# Altium schematic sheet Peripherals.SchDoc: Pepherials
size 381 x 241 mm; CompanyName: Flat Earth Inc.; DrawnBy: Connor Dack; Engineer: Connor Dack; Address1: 985 Technology Blvd; Address2: Suite 102; Address3: Bozeman, MT, 59718; DocumentNumber: 8; Revision: 0.0; SheetNumber: 8; SheetTotal: 8
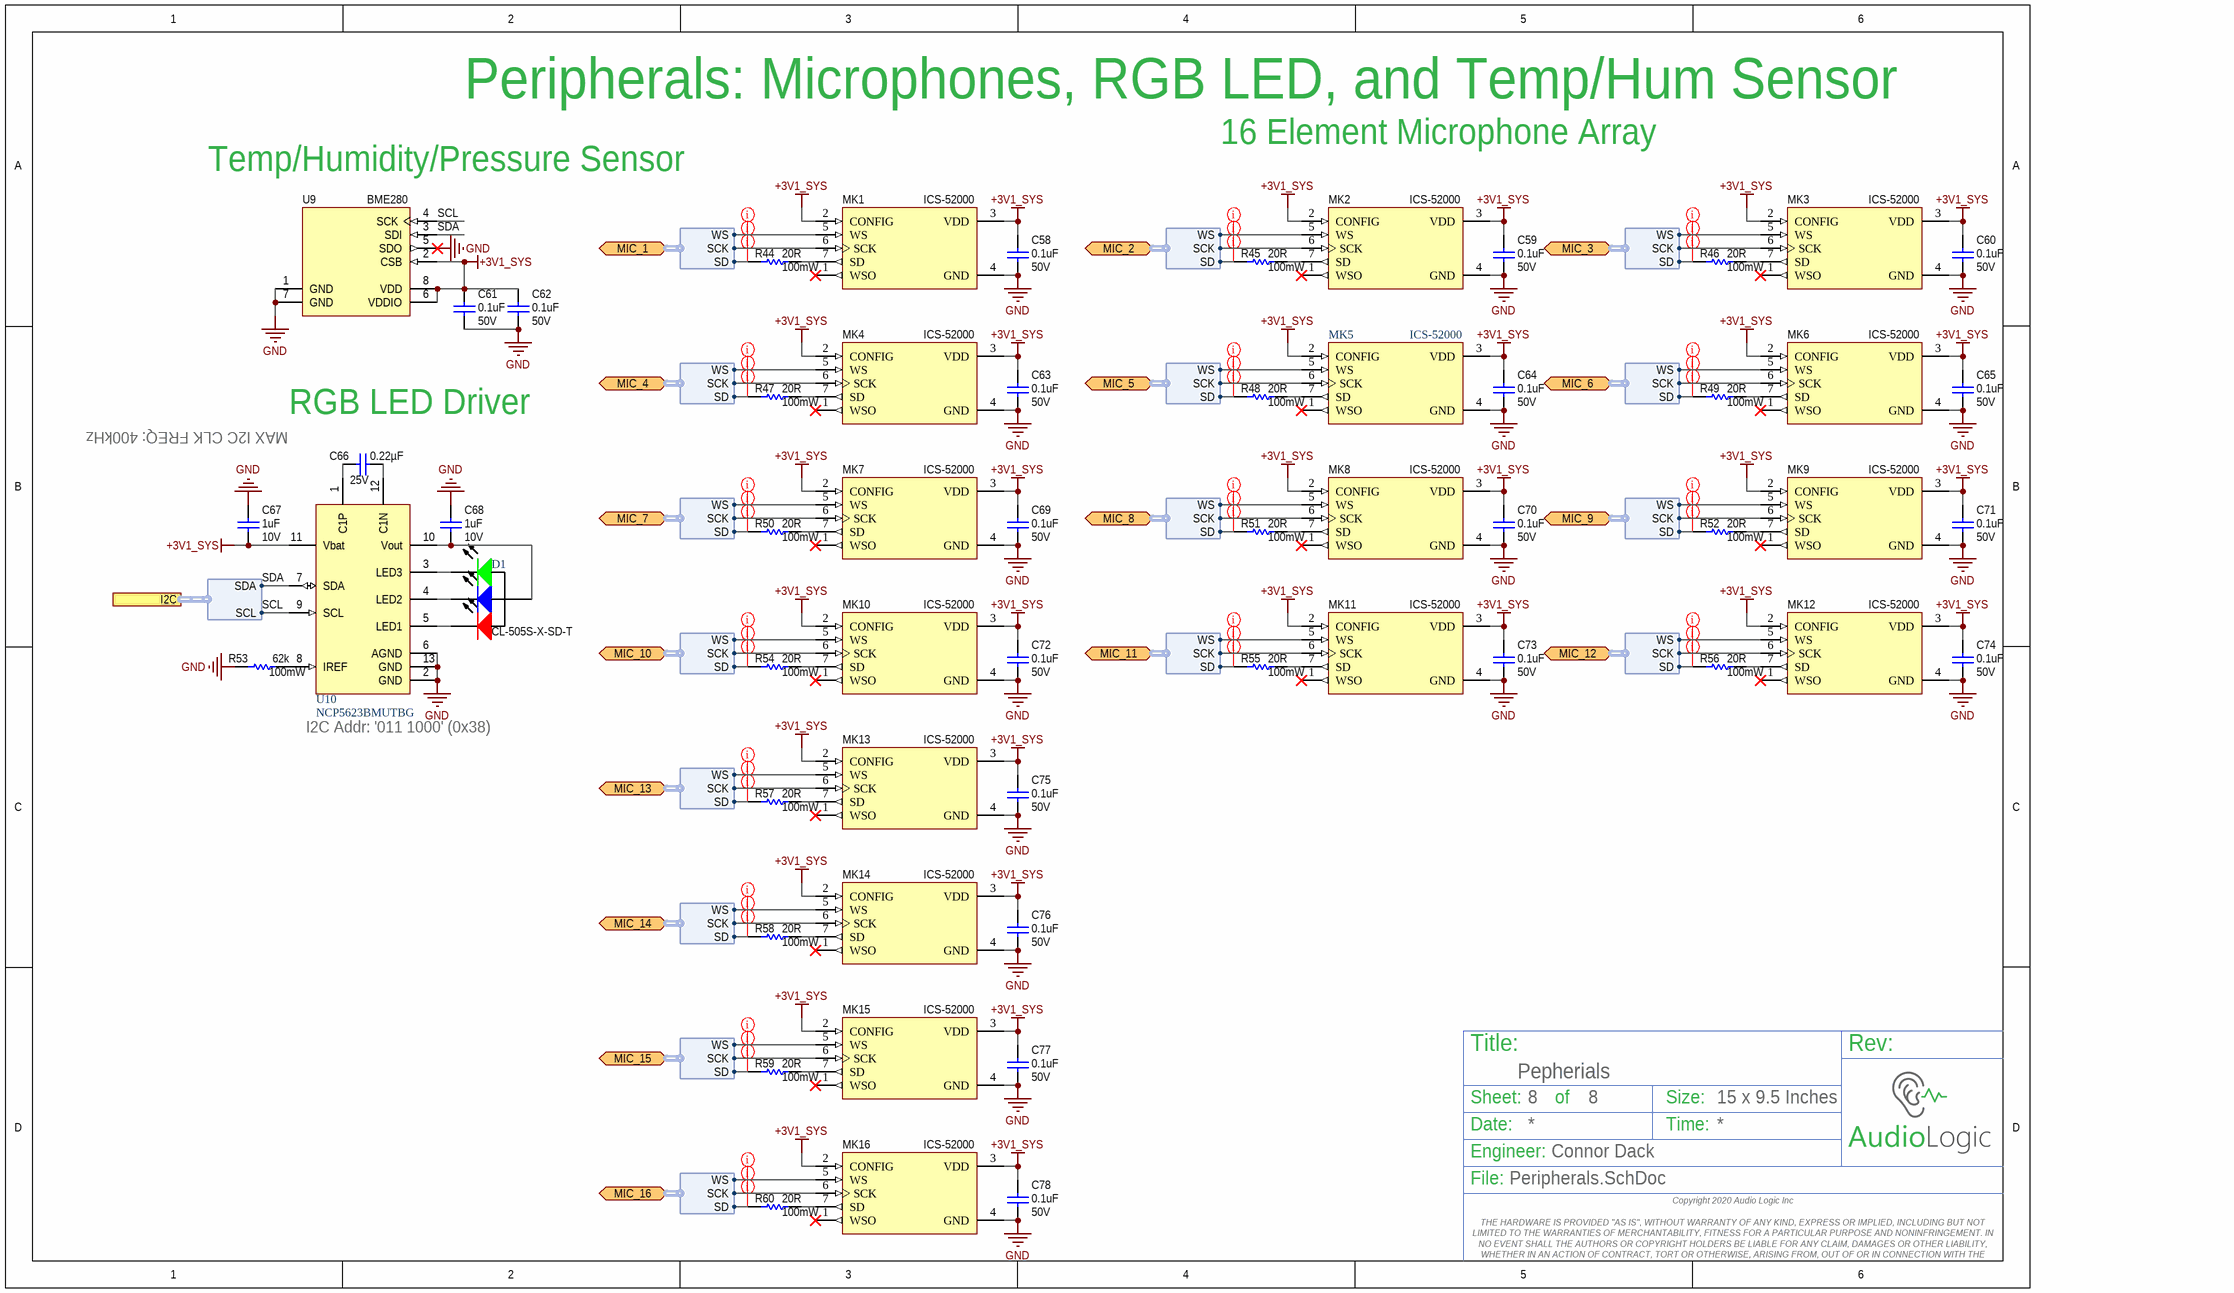
[diagram p0: Peripherals.SchDoc]

## Parts
C58  Capacitance: 0.1uF  Voltage Rating: 50V  [2-0402_L]  (hidden comment: UMK105B7104KVHF)
C59  Capacitance: 0.1uF  Voltage Rating: 50V  [2-0402_L]  (hidden comment: UMK105B7104KVHF)
C60  Capacitance: 0.1uF  Voltage Rating: 50V  [2-0402_L]  (hidden comment: UMK105B7104KVHF)
C61  Capacitance: 0.1uF  Voltage Rating: 50V  [2-0402_L]  (hidden comment: UMK105B7104KVHF)
C62  Capacitance: 0.1uF  Voltage Rating: 50V  [2-0402_L]  (hidden comment: UMK105B7104KVHF)
C63  Capacitance: 0.1uF  Voltage Rating: 50V  [2-0402_L]  (hidden comment: UMK105B7104KVHF)
C64  Capacitance: 0.1uF  Voltage Rating: 50V  [2-0402_L]  (hidden comment: UMK105B7104KVHF)
C65  Capacitance: 0.1uF  Voltage Rating: 50V  [2-0402_L]  (hidden comment: UMK105B7104KVHF)
C66  Voltage - Rated: 25V  Capacitance: 0.22µF  [2-0402_L]  (hidden comment: C1005X7R1E224K050BB)
C67  Voltage Rating: 10V  Capacitance: 1uF  [2-0402_L]  (hidden comment: CGB2A1X5R1A105K033BC)
C68  Voltage Rating: 10V  Capacitance: 1uF  [2-0402_L]  (hidden comment: CGB2A1X5R1A105K033BC)
C69  Capacitance: 0.1uF  Voltage Rating: 50V  [2-0402_L]  (hidden comment: UMK105B7104KVHF)
C70  Capacitance: 0.1uF  Voltage Rating: 50V  [2-0402_L]  (hidden comment: UMK105B7104KVHF)
C71  Capacitance: 0.1uF  Voltage Rating: 50V  [2-0402_L]  (hidden comment: UMK105B7104KVHF)
C72  Capacitance: 0.1uF  Voltage Rating: 50V  [2-0402_L]  (hidden comment: UMK105B7104KVHF)
C73  Capacitance: 0.1uF  Voltage Rating: 50V  [2-0402_L]  (hidden comment: UMK105B7104KVHF)
C74  Capacitance: 0.1uF  Voltage Rating: 50V  [2-0402_L]  (hidden comment: UMK105B7104KVHF)
C75  Capacitance: 0.1uF  Voltage Rating: 50V  [2-0402_L]  (hidden comment: UMK105B7104KVHF)
C76  Capacitance: 0.1uF  Voltage Rating: 50V  [2-0402_L]  (hidden comment: UMK105B7104KVHF)
C77  Capacitance: 0.1uF  Voltage Rating: 50V  [2-0402_L]  (hidden comment: UMK105B7104KVHF)
C78  Capacitance: 0.1uF  Voltage Rating: 50V  [2-0402_L]  (hidden comment: UMK105B7104KVHF)
D1  LED TRI TOP FIRING 1.0 X 1.0  [CL-505S]  (value not drawn)
MK1  ICS-52000  [MIC_ICS-52000]
MK2  ICS-52000  [MIC_ICS-52000]
MK3  ICS-52000  [MIC_ICS-52000]
MK4  ICS-52000  [MIC_ICS-52000]
MK5  ICS-52000  [MIC_ICS-52000]
MK6  ICS-52000  [MIC_ICS-52000]
MK7  ICS-52000  [MIC_ICS-52000]
MK8  ICS-52000  [MIC_ICS-52000]
MK9  ICS-52000  [MIC_ICS-52000]
MK10  ICS-52000  [MIC_ICS-52000]
MK11  ICS-52000  [MIC_ICS-52000]
MK12  ICS-52000  [MIC_ICS-52000]
MK13  ICS-52000  [MIC_ICS-52000]
MK14  ICS-52000  [MIC_ICS-52000]
MK15  ICS-52000  [MIC_ICS-52000]
MK16  ICS-52000  [MIC_ICS-52000]
R44  Resistance: 20R  Power Rating: 100mW  [RESC1005X40X25LL05T05]  (hidden comment: ERJ-2RKF20R0X)
R45  Resistance: 20R  Power Rating: 100mW  [RESC1005X40X25LL05T05]  (hidden comment: ERJ-2RKF20R0X)
R46  Resistance: 20R  Power Rating: 100mW  [RESC1005X40X25LL05T05]  (hidden comment: ERJ-2RKF20R0X)
R47  Resistance: 20R  Power Rating: 100mW  [RESC1005X40X25LL05T05]  (hidden comment: ERJ-2RKF20R0X)
R48  Resistance: 20R  Power Rating: 100mW  [RESC1005X40X25LL05T05]  (hidden comment: ERJ-2RKF20R0X)
R49  Resistance: 20R  Power Rating: 100mW  [RESC1005X40X25LL05T05]  (hidden comment: ERJ-2RKF20R0X)
R50  Resistance: 20R  Power Rating: 100mW  [RESC1005X40X25LL05T05]  (hidden comment: ERJ-2RKF20R0X)
R51  Resistance: 20R  Power Rating: 100mW  [RESC1005X40X25LL05T05]  (hidden comment: ERJ-2RKF20R0X)
R52  Resistance: 20R  Power Rating: 100mW  [RESC1005X40X25LL05T05]  (hidden comment: ERJ-2RKF20R0X)
R53  Power (Watts): 100mW  Resistance (Ohms): 62k  [2-0402_R_L]  (hidden comment: ERJ-2GEJ623X)
R54  Resistance: 20R  Power Rating: 100mW  [RESC1005X40X25LL05T05]  (hidden comment: ERJ-2RKF20R0X)
R55  Resistance: 20R  Power Rating: 100mW  [RESC1005X40X25LL05T05]  (hidden comment: ERJ-2RKF20R0X)
R56  Resistance: 20R  Power Rating: 100mW  [RESC1005X40X25LL05T05]  (hidden comment: ERJ-2RKF20R0X)
R57  Resistance: 20R  Power Rating: 100mW  [RESC1005X40X25LL05T05]  (hidden comment: ERJ-2RKF20R0X)
R58  Resistance: 20R  Power Rating: 100mW  [RESC1005X40X25LL05T05]  (hidden comment: ERJ-2RKF20R0X)
R59  Resistance: 20R  Power Rating: 100mW  [RESC1005X40X25LL05T05]  (hidden comment: ERJ-2RKF20R0X)
R60  Resistance: 20R  Power Rating: 100mW  [RESC1005X40X25LL05T05]  (hidden comment: ERJ-2RKF20R0X)
U9  BME280  [BOSC-BME280-8_V]
U10  IC LED DRIVER RGLTR 30MA 12LLGA  [513AA]  (value not drawn)

## Ports
I2C (harness I2C), MIC_1 (bidir, harness MIC_1), MIC_2 (bidir, harness MIC_2), MIC_3 (bidir, harness MIC_3), MIC_4 (bidir, harness MIC_4), MIC_5 (bidir, harness MIC_5), MIC_6 (bidir, harness MIC_6), MIC_7 (bidir, harness MIC_7), MIC_8 (bidir, harness MIC_8), MIC_9 (bidir, harness MIC_9), MIC_10 (bidir, harness MIC_10), MIC_11 (bidir, harness MIC_11), MIC_12 (bidir, harness MIC_12), MIC_13 (bidir, harness MIC_13), MIC_14 (bidir, harness MIC_14), MIC_15 (bidir, harness MIC_15), MIC_16 (bidir, harness MIC_16)

## Harnesses
I2C: SCL, SDA
MIC_1: WS, SCK, SD
MIC_4: WS, SCK, SD
MIC_7: WS, SCK, SD
MIC_10: WS, SCK, SD
MIC_13: WS, SCK, SD
MIC_14: WS, SCK, SD
MIC_15: WS, SCK, SD
MIC_16: WS, SCK, SD
MIC_2: WS, SCK, SD
MIC_5: WS, SCK, SD
MIC_8: WS, SCK, SD
MIC_11: WS, SCK, SD
MIC_3: WS, SCK, SD
MIC_6: WS, SCK, SD
MIC_9: WS, SCK, SD
MIC_12: WS, SCK, SD

## Nets
+3V1_SYS: C58.2 C59.2 C60.2 C61.2 C62.2 C63.2 C64.2 C65.2 C67.2 C69.2 C70.2 C71.2 C72.2 C73.2 C74.2 C75.2 C76.2 C77.2 C78.2 MK1.2(CONFIG) MK1.3(VDD) MK2.2(CONFIG) MK2.3(VDD) MK3.2(CONFIG) MK3.3(VDD) MK4.2(CONFIG) MK4.3(VDD) MK5.2(CONFIG) MK5.3(VDD) MK6.2(CONFIG) MK6.3(VDD) MK7.2(CONFIG) MK7.3(VDD) MK8.2(CONFIG) MK8.3(VDD) MK9.2(CONFIG) MK9.3(VDD) MK10.2(CONFIG) MK10.3(VDD) MK11.2(CONFIG) MK11.3(VDD) MK12.2(CONFIG) MK12.3(VDD) MK13.2(CONFIG) MK13.3(VDD) MK14.2(CONFIG) MK14.3(VDD) MK15.2(CONFIG) MK15.3(VDD) MK16.2(CONFIG) MK16.3(VDD) U9.2(CSB) U9.6(VDDIO) U9.8(VDD) U10.11(Vbat)
GND: C58.1 C59.1 C60.1 C61.1 C62.1 C63.1 C64.1 C65.1 C67.1 C68.2 C69.1 C70.1 C71.1 C72.1 C73.1 C74.1 C75.1 C76.1 C77.1 C78.1 MK1.4(GND) MK2.4(GND) MK3.4(GND) MK4.4(GND) MK5.4(GND) MK6.4(GND) MK7.4(GND) MK8.4(GND) MK9.4(GND) MK10.4(GND) MK11.4(GND) MK12.4(GND) MK13.4(GND) MK14.4(GND) MK15.4(GND) MK16.4(GND) R53.1 U9.1(GND) U9.5(SDO) U9.7(GND) U10.2(GND) U10.6(AGND) U10.13(GND)
SCL: U9.4(SCK) U10.9(SCL) ; port I2C.SCL
SDA: U9.3(SDI) U10.7(SDA) ; port I2C.SDA
NetC66_1: C66.1 U10.1(C1P)
NetC66_2: C66.2 U10.12(C1N)
NetC68_1: C68.1 D1.4(A) U10.10(Vout)
NetD1_1: D1.1(K) U10.4(LED2)
NetD1_2: D1.2(K) U10.5(LED1)
NetD1_3: D1.3(K) U10.3(LED3)
NetMK1_5: MK1.5(WS) ; port MIC_1.WS
NetMK1_6: MK1.6(SCK) ; port MIC_1.SCK
NetMK1_7: MK1.7(SD) R44.2
NetMK2_5: MK2.5(WS) ; port MIC_2.WS
NetMK2_6: MK2.6(SCK) ; port MIC_2.SCK
NetMK2_7: MK2.7(SD) R45.2
NetMK3_5: MK3.5(WS) ; port MIC_3.WS
NetMK3_6: MK3.6(SCK) ; port MIC_3.SCK
NetMK3_7: MK3.7(SD) R46.2
NetMK4_5: MK4.5(WS) ; port MIC_4.WS
NetMK4_6: MK4.6(SCK) ; port MIC_4.SCK
NetMK4_7: MK4.7(SD) R47.2
NetMK5_5: MK5.5(WS) ; port MIC_5.WS
NetMK5_6: MK5.6(SCK) ; port MIC_5.SCK
NetMK5_7: MK5.7(SD) R48.2
NetMK6_5: MK6.5(WS) ; port MIC_6.WS
NetMK6_6: MK6.6(SCK) ; port MIC_6.SCK
NetMK6_7: MK6.7(SD) R49.2
NetMK7_5: MK7.5(WS) ; port MIC_7.WS
NetMK7_6: MK7.6(SCK) ; port MIC_7.SCK
NetMK7_7: MK7.7(SD) R50.2
NetMK8_5: MK8.5(WS) ; port MIC_8.WS
NetMK8_6: MK8.6(SCK) ; port MIC_8.SCK
NetMK8_7: MK8.7(SD) R51.2
NetMK9_5: MK9.5(WS) ; port MIC_9.WS
NetMK9_6: MK9.6(SCK) ; port MIC_9.SCK
NetMK9_7: MK9.7(SD) R52.2
NetMK10_5: MK10.5(WS) ; port MIC_10.WS
NetMK10_6: MK10.6(SCK) ; port MIC_10.SCK
NetMK10_7: MK10.7(SD) R54.2
NetMK11_5: MK11.5(WS) ; port MIC_11.WS
NetMK11_6: MK11.6(SCK) ; port MIC_11.SCK
NetMK11_7: MK11.7(SD) R55.2
NetMK12_5: MK12.5(WS) ; port MIC_12.WS
NetMK12_6: MK12.6(SCK) ; port MIC_12.SCK
NetMK12_7: MK12.7(SD) R56.2
NetMK13_5: MK13.5(WS) ; port MIC_13.WS
NetMK13_6: MK13.6(SCK) ; port MIC_13.SCK
NetMK13_7: MK13.7(SD) R57.2
NetMK14_5: MK14.5(WS) ; port MIC_14.WS
NetMK14_6: MK14.6(SCK) ; port MIC_14.SCK
NetMK14_7: MK14.7(SD) R58.2
NetMK15_5: MK15.5(WS) ; port MIC_15.WS
NetMK15_6: MK15.6(SCK) ; port MIC_15.SCK
NetMK15_7: MK15.7(SD) R59.2
NetMK16_5: MK16.5(WS) ; port MIC_16.WS
NetMK16_6: MK16.6(SCK) ; port MIC_16.SCK
NetMK16_7: MK16.7(SD) R60.2
NetR44_1: R44.1 ; port MIC_1.SD
NetR45_1: R45.1 ; port MIC_2.SD
NetR46_1: R46.1 ; port MIC_3.SD
NetR47_1: R47.1 ; port MIC_4.SD
NetR48_1: R48.1 ; port MIC_5.SD
NetR49_1: R49.1 ; port MIC_6.SD
NetR50_1: R50.1 ; port MIC_7.SD
NetR51_1: R51.1 ; port MIC_8.SD
NetR52_1: R52.1 ; port MIC_9.SD
NetR53_2: R53.2 U10.8(IREF)
NetR54_1: R54.1 ; port MIC_10.SD
NetR55_1: R55.1 ; port MIC_11.SD
NetR56_1: R56.1 ; port MIC_12.SD
NetR57_1: R57.1 ; port MIC_13.SD
NetR58_1: R58.1 ; port MIC_14.SD
NetR59_1: R59.1 ; port MIC_15.SD
NetR60_1: R60.1 ; port MIC_16.SD

Not connected (* = marked no-connect by the designer): MK1 1(WSO)*; MK2 1(WSO)*; MK3 1(WSO)*; MK4 1(WSO)*; MK5 1(WSO)*; MK6 1(WSO)*; MK7 1(WSO)*; MK8 1(WSO)*; MK9 1(WSO)*; MK10 1(WSO)*; MK11 1(WSO)*; MK12 1(WSO)*; MK13 1(WSO)*; MK14 1(WSO)*; MK15 1(WSO)*; MK16 1(WSO)*

## Layout directives
net class Mic Clock: NetMK1_6, NetMK2_6, NetMK3_6, NetMK4_6, NetMK5_6, NetMK6_6, NetMK8_6, NetMK9_6, NetMK11_6, NetMK12_6, NetMK13_6, NetMK14_6, NetMK15_6, NetMK16_6
net class Mic Clock; rule Matched Net Lengths [Tolerance = 10mil]; rule Matched Net Lengths [Tolerance = 10mil]: NetMK7_6
net class Mic Clock; rule Matched Net Lengths [Tolerance = 10mil]: NetMK10_6
net class Mic WS; rule Matched Net Lengths [Tolerance = 10mil]: NetMK1_5, NetMK2_5, NetMK3_5, NetMK4_5, NetMK5_5, NetMK6_5, NetMK7_5, NetMK8_5, NetMK9_5, NetMK10_5, NetMK11_5, NetMK12_5, NetMK13_5, NetMK14_5, NetMK15_5, NetMK16_5
net class Mic SD; rule Matched Net Lengths [Tolerance = 10mil]: NetR44_1, NetR45_1, NetR46_1, NetR47_1, NetR48_1, NetR49_1, NetR50_1, NetR51_1, NetR52_1, NetR54_1, NetR55_1, NetR56_1, NetR57_1, NetR58_1, NetR59_1, NetR60_1

## Notes on the sheet
- Peripherals: Microphones, RGB LED, and Temp/Hum Sensor
- 16 Element Microphone Array
- (near U9) Temp/Humidity/Pressure Sensor
- (near C66) RGB LED Driver
- (near C66) MAX I2C CLK FREQ: 400kHz
- I2C Addr: '011 1000' (0x38)
- Title:
- Sheet:
- of
- Size:
- 15 x 9.5 Inches
- Rev:
- Date:
- Engineer:
- Time:
- File:
- Copyright 2020 Audio Logic Inc
  THE HARDWARE IS PROVIDED "AS IS", WITHOUT WARRANTY OF ANY KIND, EXPRESS OR IMPLIED, INCLUDING BUT NOT LIMITED TO THE WARRANTIES OF MERCHANTABILITY, FITNESS FOR A PARTICULAR PURPOSE AND NONINFRINGEMENT. IN NO EVENT SHALL THE AUTHORS OR COPYRIGHT HOLDERS BE LIABLE FOR ANY CLAIM, DAMAGES OR OTHER LIABILITY, WHETHER IN AN ACTION OF CONTRACT, TORT OR OTHERWISE, ARISING FROM, OUT OF OR IN CONNECTION WITH THE HARDWARE OR THE USE OR OTHER DEALINGS IN THE HARDWARE.

## Library data of the parts
C58-C65 C69-C78 = UMK105B7104KVHF: CAP CER 0.1uF 50V X7R +/-10% 0402 AEC-Q200; Manufacturer: Taiyo Yuden; Tolerance: 10%; Supplier 1: Digi-Key; Manufacturer Part Number: UMK105B7104KVHF; Stock 1: 100000; Pricing 1: 1=0.23, 10=0.165, 100=0.0775, 500=0.05436, 1000=0.04501, 2500=0.04189, 5000=0.03832 (USD); Packaging: Tape and Reel; ComponentLink1URL: http://www.yuden.co.jp/productdata/catalog/en/mlcc01_hq_e.pdf; ComponentLink1Description: http://www.yuden.co.jp/productdata/catalog/en/mlcc01_hq_e.pdf; Supplier Part Number 1: 587-4330-1-ND; Mount: Surface Mount; Case/Package: 0402; Case Code (Metric): 1005; Case Code (Imperial): 0402; Min Operating Temperature: -55°C; Max Operating Temperature: 125°C; Package Quantity: 10000; Dielectric: X7R; Voltage Rating (DC): 50V; Length: 0.039inch; Height: 0.5mm; Width: 0.02inch; Thickness: 0.022inch; ComponentLink2URL: http://ds.yuden.co.jp/TYCOMPAS/ut/detail.do?productNo=UMK105B7104KVHF&fileName=UMK105B7104KVHF_SS&mode=specSheetDownload; ComponentLink2Description: http://ds.yuden.co.jp/TYCOMPAS/ut/detail.do?productNo=UMK105B7104KVHF&fileName=UMK105B7104KVHF_SS&mode=specSheetDownload; ComponentLink3URL: http://www.mouser.com/ds/2/396/mlcc11_hq_e-541564.pdf; ComponentLink3Description: http://www.mouser.com/ds/2/396/mlcc11_hq_e-541564.pdf; ComponentLink4URL: http://ds.yuden.co.jp/TYCOMPAS/ut/detail.do?productNo=UMK105B7104KVHF&dataUnit=M; ComponentLink4Description: http://ds.yuden.co.jp/TYCOMPAS/ut/detail.do?productNo=UMK105B7104KVHF&dataUnit=M; Weight: 2.3E-05oz; Termination: SMD/SMT
C66 = C1005X7R1E224K050BB: CAP CER 0.22UF 25V X7R 0402; Manufacturer: TDK Corporation; Tolerance: ±10%; Supplier 1: Digi-Key; Manufacturer Part Number: C1005X7R1E224K050BB; RoHS: RoHS Compliant; Category: Capacitors; Stock 1: 304; Pricing 1: 1=0.17, 10=0.12, 100=0.057, 250=0.048, 500=0.0402, 1000=0.033, 5000=0.0279 (USD); Packaging: Cut Tape (CT); Part Status: Active; Temperature Coefficient: X7R; Operating Temperature: -55°C ~ 125°C; Features: Low ESL; Ratings: -; Applications: General Purpose; Failure Rate: -; Mounting Type: Surface Mount, MLCC; Package / Case: 0402 (1005 Metric); Size / Dimension: 0.039" L x 0.020" W (1.00mm x 0.50mm); Height - Seated (Max): -; Thickness (Max): 0.022" (0.55mm); Lead Spacing: -; Lead Style: -; ComponentLink1URL: https://product.tdk.com/info/en/catalog/datasheets/mlcc_commercial_general_en.pdf; ComponentLink1Description: https://product.tdk.com/info/en/catalog/datasheets/mlcc_commercial_general_en.pdf; Supplier Part Number 1: 445-174421-1-ND
C67 C68 = CGB2A1X5R1A105K033BC: CAP CER 1UF 10V X5R 0402; Manufacturer: TDK; Tolerance: 10%; Supplier 1: Digi-Key; Manufacturer Part Number: CGB2A1X5R1A105K033BC; Stock 1: 48118; Pricing 1: 1=0.2, 10=0.14, 100=0.066, 500=0.0463, 1000=0.0383, 2500=0.0357, 5000=0.0326 (USD); Mount: Surface Mount; Case/Package: 0402; Case Code (Metric): 1005; Case Code (Imperial): 0402; Min Operating Temperature: -55°C; Max Operating Temperature: 85°C; Package Quantity: 10000; Packaging: Tape and Reel; Length: 0.039inch; Width: 0.02inch; Thickness: 0.013inch; Lead Free: Lead Free; ComponentLink1URL: http://product.tdk.com/en/catalog/datasheets/mlcc_commercial_lowprofile_en.pdf; ComponentLink1Description: http://product.tdk.com/en/catalog/datasheets/mlcc_commercial_lowprofile_en.pdf; ComponentLink2URL: https://product.tdk.com/info/en/catalog/datasheets/mlcc_commercial_lowprofile_en.pdf; ComponentLink2Description: https://product.tdk.com/info/en/catalog/datasheets/mlcc_commercial_lowprofile_en.pdf; Supplier Part Number 1: 445-13179-1-ND
D1 = CL-505S-X-SD-T: Red, Green, Blue (RGB) 615nm Red, 530nm Green, 470nm Blue LED Indication - Discrete 1.85V Red, 2.7V Green, 2.75V Blue 0404 (1010 Metric); Manufacturer: Citizen; Colour: Blue,Green,Red; Luminous Intensity: 65mcd; Test Current: 5mA; Mount: Surface Mount; Case/Package: 0404; Case Code (Metric): 1010; Case Code (Imperial): 0404; Packaging: Tape and Reel; Dominant Wavelength: 470nm; Forward Voltage: 2.75V; Length: 1mm; Height: 0.26mm; Width: 1mm; Manufacturer Part Number: CL-505S-X-SD-T; ComponentLink1Description: CL-505S Datasheet; ComponentLink1URL: http://ce.citizen.co.jp/up_img/product/sQNrj4RlM7o2/CL-505S_e.pdf
MK1-MK16 = ICS-52000: MIC MEMS DIGITAL OMNI -26DB; Manufacturer: TDK InvenSense; Supplier 1: Digi-Key; Manufacturer Part Number: ICS-52000; RoHS: No; Category: Microphones; Stock 1: 3554; Pricing 1: 1=4.06000, 10=3.35700, 25=3.09760, 50=2.90920, 100=2.72790, 500=2.35338 (USD); ComponentLink1URL: http://www.farnell.com/datasheets/2632667.pdf?src-supplier=Farnell; ComponentLink1Description: http://www.farnell.com/datasheets/2632667.pdf?src-supplier=Farnell; ComponentLink2URL: https://www.invensense.com/wp-content/uploads/2016/05/PB-000039-ICS-52000-v0.1.pdf?src-supplier=Digi-Key; ComponentLink2Description: https://www.invensense.com/wp-content/uploads/2016/05/PB-000039-ICS-52000-v0.1.pdf?src-supplier=Digi-Key; ComponentLink3URL: https://www.invensense.com/wp-content/uploads/2016/05/DS-000121-ICS-52000-v1.3.pdf?src-supplier=Digi-Key; ComponentLink3Description: https://www.invensense.com/wp-content/uploads/2016/05/DS-000121-ICS-52000-v1.3.pdf?src-supplier=Digi-Key; Supplier Part Number 1: 1428-1122-1-ND
R44-R52 R54-R60 = CMP-2002-00765-1: RES SMD 20 OHM 1% 1/10W 0402; Manufacturer: Panasonic; Voltage Rating: 50V; Temperature Coefficient: 100ppm/°C; Part Number: ERJ-2RKF20R0X; Supplier 1: Digi-Key; Supplier Part Number 1: P20.0LCT-ND; Manufacturer Part Number: ERJ-2RKF20R0X; RoHS: Yes; Category: Chip SMD Resistors; Stock 1: 156306; Pricing 1: 1=0.10000, 10=0.04100, 100=0.01670, 1000=0.00751, 2500=0.00652, 5000=0.00538 (USD); Mount: Surface Mount; Case/Package: 0402; Weight: 2.8E-05oz; Case Code (Metric): 1005; Case Code (Imperial): 0402; Contact Plating: Tin; Min Operating Temperature: -55°C; Max Operating Temperature: 155°C; Tolerance: 1%; Packaging: Tape and Reel; Package Quantity: 1; Composition: Thick Film; Number of Terminations: 2; Termination: SMD/SMT; Military Standard: Not; Max Power Dissipation: 100mW; Voltage Rating (DC): 50V; Features: Automotive AEC-Q200; Length: 1mm; Height: 0.35mm; Width: 0.02inch; Depth: 0.5mm; REACH SVHC: No SVHC; Lead Free: Lead Free; ComponentLink1URL: https://datasheet.ciiva.com/11821/0900766b80f80784-11821238.pdf?src-supplier=RSComponents; ComponentLink1Description: https://datasheet.ciiva.com/11821/0900766b80f80784-11821238.pdf?src-supplier=RSComponents; ComponentLink2URL: https://datasheet.ciiva.com/28665/1678782-28665382.pdf?src-supplier=Element14; ComponentLink2Description: https://datasheet.ciiva.com/28665/1678782-28665382.pdf?src-supplier=Element14; ComponentLink3URL: https://datasheet.ciiva.com/43460/426256-43460268.pdf?src-supplier=Farnell; ComponentLink3Description: https://datasheet.ciiva.com/43460/426256-43460268.pdf?src-supplier=Farnell; ComponentLink4URL: https://datasheet.ciiva.com/24159/aoa0000ce2-24159789.pdf?src-supplier=Mouser; ComponentLink4Description: https://datasheet.ciiva.com/24159/aoa0000ce2-24159789.pdf?src-supplier=Mouser; ComponentLink5URL: https://datasheet.ciiva.com/16769/70260748-16769269.pdf?src-supplier=Allied+Electronics; ComponentLink5Description: https://datasheet.ciiva.com/16769/70260748-16769269.pdf?src-supplier=Allied+Electronics; ComponentLink6URL: https://datasheet.ciiva.com/16780/70260748-16780614.pdf?src-supplier=Allied+Electronics; ComponentLink6Description: https://datasheet.ciiva.com/16780/70260748-16780614.pdf?src-supplier=Allied+Electronics; ComponentLink7URL: https://datasheet.ciiva.com/46386/426256-46386872.pdf?src-supplier=Element14; ComponentLink7Description: https://datasheet.ciiva.com/46386/426256-46386872.pdf?src-supplier=Element14
R53 = ERJ-2GEJ623X: RES SMD 62K OHM 5% 1/10W 0402; Manufacturer: Panasonic Electronic Components; Temperature Coefficient: ±200ppm/°C; Supplier 1: Digi-Key; Manufacturer Part Number: ERJ-2GEJ623X; RoHS: RoHS Compliant; Category: Resistors; Stock 1: 135575; Pricing 1: 1=0.1, 10=0.017, 25=0.0128, 50=0.0096, 100=0.0071, 250=0.0054, 500=0.00432, 1000=0.00318, 5000=0.00228 (USD); Packaging: Cut Tape (CT); Part Status: Active; Tolerance: ±5%; Composition: Thick Film; Features: Automotive AEC-Q200; Operating Temperature: -55°C ~ 155°C; Package / Case: 0402 (1005 Metric); Supplier Device Package: 0402; Size / Dimension: 0.039" L x 0.020" W (1.00mm x 0.50mm); Height - Seated (Max): 0.016" (0.40mm); Number of Terminations: 2; Failure Rate: -; ComponentLink1URL: http://industrial.panasonic.com/www-cgi/jvcr13pz.cgi?E+PZ+3+AOA0001+ERJ2GEJ623X+7+WW; ComponentLink1Description: http://industrial.panasonic.com/www-cgi/jvcr13pz.cgi?E+PZ+3+AOA0001+ERJ2GEJ623X+7+WW; Supplier Part Number 1: P62KJCT-ND
U9 = CMP-2000-05073-1: Combined Humidity and Pressure Sensor, 1.71 to 3.6 V, -40 to 85 degC, 8-Pin SMD, RoHS, Tape and Reel; Manufacturer: Bosch Sensortec; Datasheet Version: Rev. 1.2, 10/2015; Datasheet URL: http://datasheet.octopart.com/BME280-Bosch-datasheet-58577763.pdf; Manufacturer URL: http://www.bosch-sensortec.com
U10 = NCP5623BMUTBG: LED Driver IC 3 Output DC DC Regulator Switched Capacitor (Charge Pump) 30mA 12-LLGA (2x2); Manufacturer: ON Semiconductor; Output Voltage: 5.7V; Output Current: 90mA; Min Supply Voltage: 2.7V; Max Supply Voltage: 5.5V; Number of Outputs: 3; Frequency: 1.2MHz; Max Power Dissipation: 200mW; Max Supply Current: 1mA; Switching Frequency: 1MHz; Mount: Surface Mount; Number of Pins: 12; Contact Plating: Gold; Min Operating Temperature: -40°C; Max Operating Temperature: 85°C; Packaging: Tape and Reel; Topology: Charge Pump; Package Quantity: 3000; High Level Output Current: 90mA; Power Dissipation: 200mW; Number of Segments: 3; Min Input Voltage: 2.7V; Max Input Voltage: 5.5V; Length: 2mm; Height: 0.55mm; Width: 2mm; Radiation Hardening: No; Lead Free: Lead Free; Halogen Free: Halogen Free; REACH SVHC: No SVHC; ComponentLink1URL: http://uk.rs-online.com/webdocs/1270/0900766b812703f5.pdf; ComponentLink1Description: http://uk.rs-online.com/webdocs/1270/0900766b812703f5.pdf; ComponentLink2URL: http://www.onsemi.com/pub/Collateral/NCP5623B-D.PDF; ComponentLink2Description: http://www.onsemi.com/pub/Collateral/NCP5623B-D.PDF; ComponentLink3URL: http://www.onsemi.jp/pub/Collateral/NCP5623B-D.PDF; ComponentLink3Description: http://www.onsemi.jp/pub/Collateral/NCP5623B-D.PDF; ComponentLink4URL: http://www.mouser.com/ds/2/308/NCP5623B-D-60674.pdf; ComponentLink4Description: http://www.mouser.com/ds/2/308/NCP5623B-D-60674.pdf; ComponentLink5URL: http://www.onsemi.ru.com/pub_link/Collateral/NCP5623B-D.PDF; ComponentLink5Description: http://www.onsemi.ru.com/pub_link/Collateral/NCP5623B-D.PDF; Manufacturer Part Number: NCP5623BMUTBG